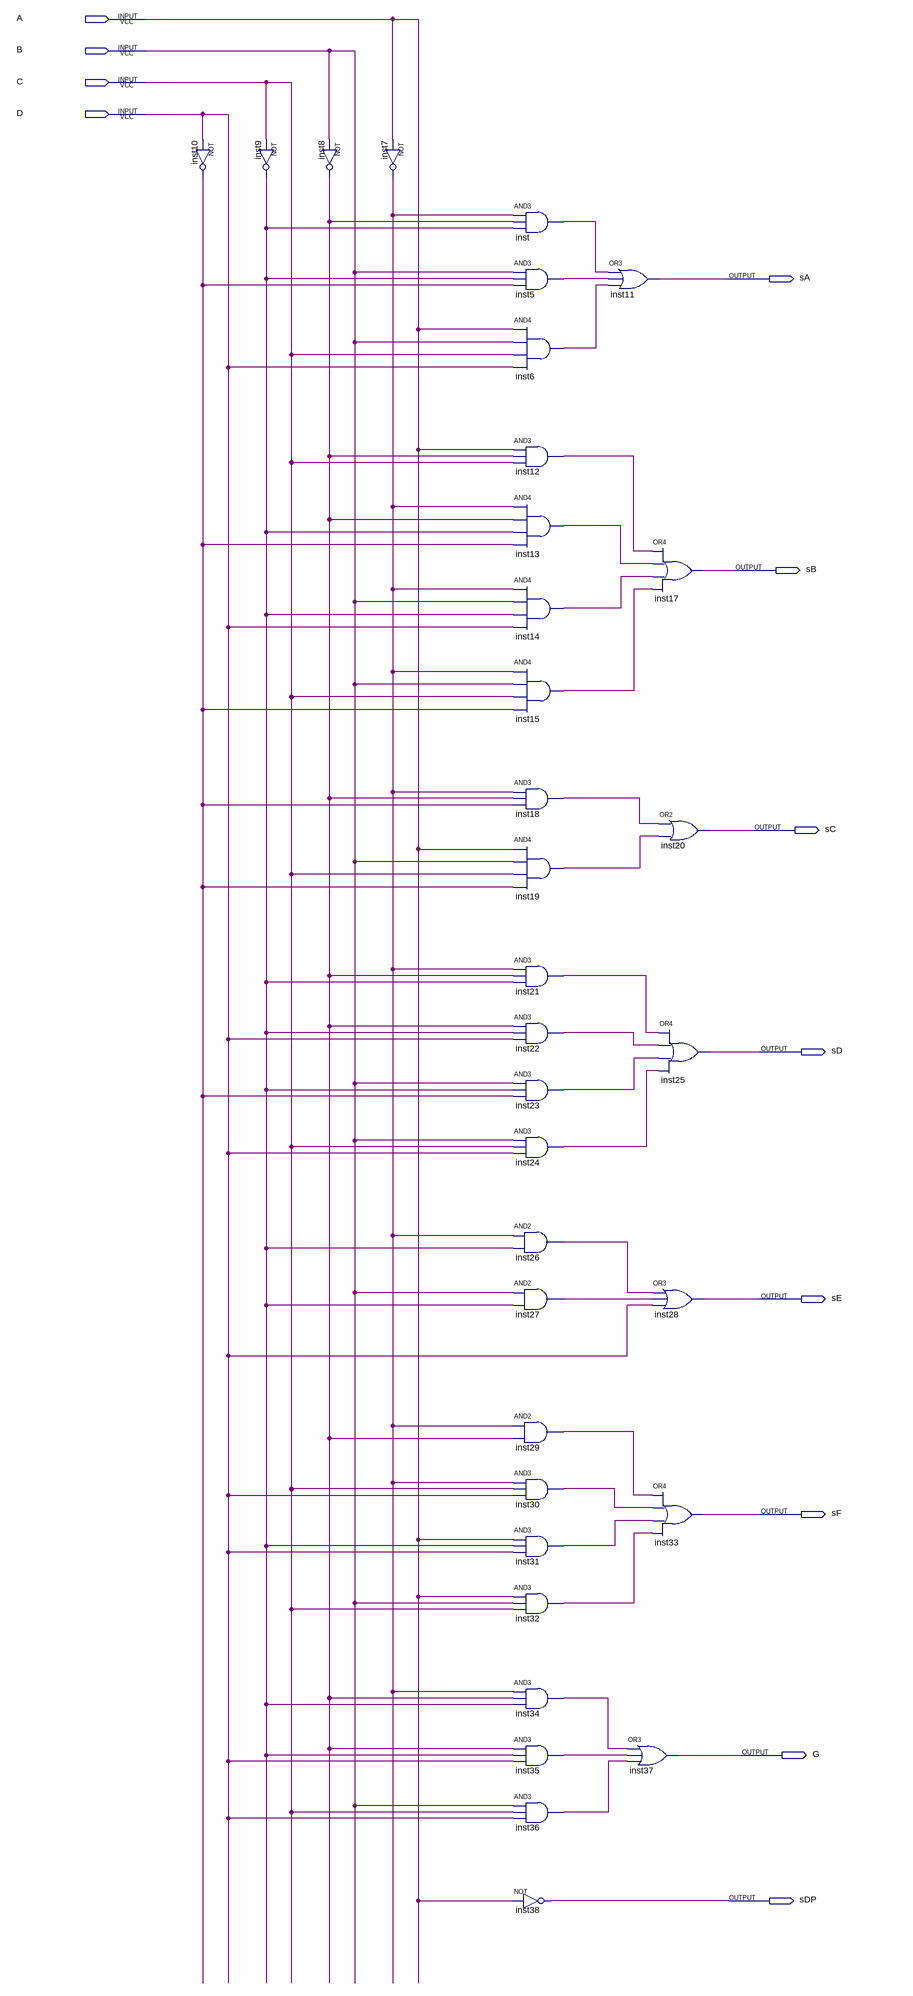
[diagram p0: schematic sheet]
// Quartus schematic decodificador_parcela.bdf as structural Verilog: 34 symbols, 12 pins
module decodificador_parcela (
  input  A,
  input  B,
  input  C,
  input  D,
  output sA,
  output sB,
  output sC,
  output sD,
  output sE,
  output sF,
  output G,
  output sDP
);

  wire inst5_out, inst6_out, inst7_out, inst8_out, inst9_out, inst10_out, inst12_out, inst13_out, inst14_out,
       inst15_out, inst18_out, inst19_out, inst21_out, inst22_out, inst23_out, inst24_out, inst26_out,
       inst27_out, inst29_out, inst30_out, inst31_out, inst32_out, inst34_out, inst35_out, inst36_out,
       inst_out;

  not inst10 (inst10_out, D);
  not inst9 (inst9_out, C);
  not inst8 (inst8_out, B);
  not inst7 (inst7_out, A);
  and inst (inst_out, inst7_out, inst8_out, inst9_out);
  and inst5 (inst5_out, B, inst9_out, inst10_out);
  and inst6 (inst6_out, A, B, C, D);
  and inst12 (inst12_out, A, inst8_out, C);
  and inst13 (inst13_out, inst7_out, inst8_out, inst9_out, inst10_out);
  and inst14 (inst14_out, inst7_out, B, inst9_out, D);
  and inst15 (inst15_out, inst7_out, B, C, inst10_out);
  and inst18 (inst18_out, inst7_out, inst8_out, inst10_out);
  and inst19 (inst19_out, A, B, C, inst10_out);
  and inst21 (inst21_out, inst7_out, inst8_out, inst9_out);
  and inst22 (inst22_out, inst8_out, inst9_out, D);
  and inst23 (inst23_out, B, inst9_out, inst10_out);
  and inst24 (inst24_out, B, C, D);
  and inst26 (inst26_out, inst7_out, inst9_out);
  and inst27 (inst27_out, B, inst9_out);
  and inst29 (inst29_out, inst7_out, inst8_out);
  and inst30 (inst30_out, inst7_out, C, D);
  and inst31 (inst31_out, A, inst9_out, D);
  and inst32 (inst32_out, A, B, C);
  and inst34 (inst34_out, inst7_out, inst8_out, inst9_out);
  and inst35 (inst35_out, inst8_out, inst9_out, D);
  and inst36 (inst36_out, B, C, D);
  not inst38 (sDP, A);
  or inst11 (sA, inst_out, inst5_out, inst6_out);
  or inst17 (sB, inst12_out, inst13_out, inst14_out, inst15_out);
  or inst20 (sC, inst18_out, inst19_out);
  or inst25 (sD, inst21_out, inst22_out, inst23_out, inst24_out);
  or inst28 (sE, inst26_out, inst27_out, D);
  or inst33 (sF, inst29_out, inst30_out, inst31_out, inst32_out);
  or inst37 (G, inst34_out, inst35_out, inst36_out);
endmodule
